# EAGLE design Utility Module (EAGLE 7.7.0)
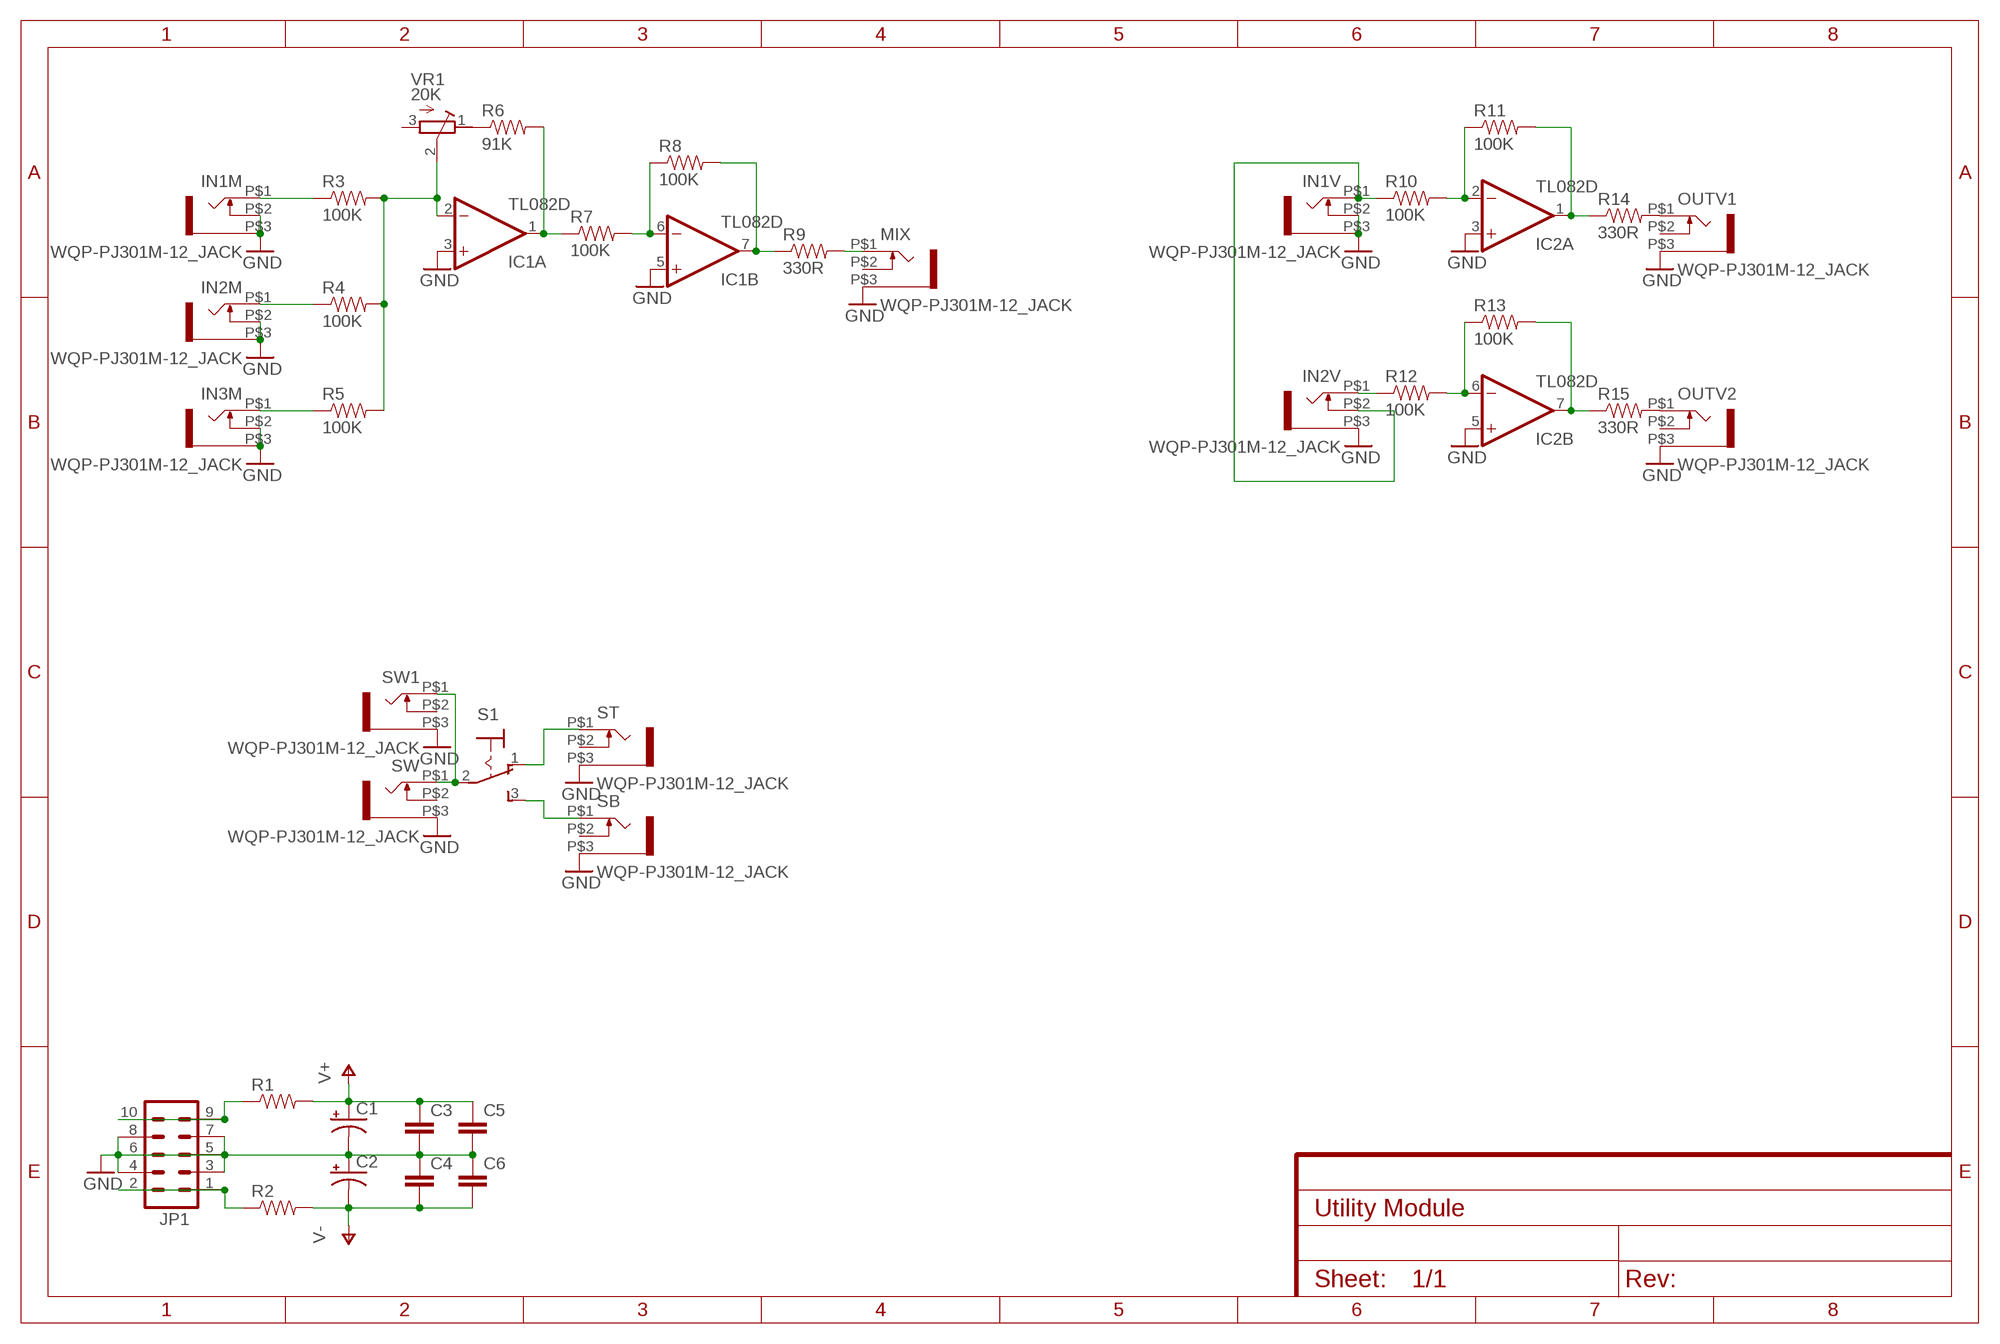
[diagram p0: schematic, sheet 1]

## Parts
C1  CAP_POLC  [PANASONIC_C]
C2  CAP_POLC  [PANASONIC_C]
C3  CAP0805  [0805]
C4  CAP0805  [0805]
C5  CAP0805  [0805]
C6  CAP0805  [0805]
IC1  TL082D  [SO08]
IC2  TL082D  [SO08]
IN1M  WQP-PJ301M-12_JACK  [WQP-PJ301M-12_JACK]
IN1V  WQP-PJ301M-12_JACK  [WQP-PJ301M-12_JACK]
IN2M  WQP-PJ301M-12_JACK  [WQP-PJ301M-12_JACK]
IN2V  WQP-PJ301M-12_JACK  [WQP-PJ301M-12_JACK]
IN3M  WQP-PJ301M-12_JACK  [WQP-PJ301M-12_JACK]
JP1  M05X2PTH  [AVR_ICSP]
MIX  WQP-PJ301M-12_JACK  [WQP-PJ301M-12_JACK]
OUTV1  WQP-PJ301M-12_JACK  [WQP-PJ301M-12_JACK]
OUTV2  WQP-PJ301M-12_JACK  [WQP-PJ301M-12_JACK]
R1  RESISTOR0805-RES  [0805]
R2  RESISTOR0805-RES  [0805]
R3  100K  RESISTOR0805-RES  [0805]
R4  100K  RESISTOR0805-RES  [0805]
R5  100K  RESISTOR0805-RES  [0805]
R6  91K  RESISTOR0805-RES  [0805]
R7  100K  RESISTOR0805-RES  [0805]
R8  100K  RESISTOR0805-RES  [0805]
R9  330R  RESISTOR0805-RES  [0805]
R10  100K  RESISTOR0805-RES  [0805]
R11  100K  RESISTOR0805-RES  [0805]
R12  100K  RESISTOR0805-RES  [0805]
R13  100K  RESISTOR0805-RES  [0805]
R14  330R  RESISTOR0805-RES  [0805]
R15  330R  RESISTOR0805-RES  [0805]
S1  M9040P  [M9040P]
SB  WQP-PJ301M-12_JACK  [WQP-PJ301M-12_JACK]
ST  WQP-PJ301M-12_JACK  [WQP-PJ301M-12_JACK]
SW  WQP-PJ301M-12_JACK  [WQP-PJ301M-12_JACK]
SW1  WQP-PJ301M-12_JACK  [WQP-PJ301M-12_JACK]
VR1  20K  R-TRIMM3314G  [RTRIM3314G]

## Nets
GND: C1.- C2.+ C3.2 C4.1 C5.2 C6.1 IC1.3(A:+IN) IC1.5(B:+IN) IC2.3(A:+IN) IC2.5(B:+IN) IN1M.P$2 IN1M.P$3 IN1V.P$2 IN1V.P$3 IN2M.P$2 IN2M.P$3 IN2V.P$3 IN3M.P$2 IN3M.P$3 JP1.3 JP1.4 JP1.5 JP1.6 JP1.7 JP1.8 MIX.P$3 OUTV1.P$3 OUTV2.P$3 SB.P$3 ST.P$3 SW1.P$3 SW.P$3
N$1: R6.1 VR1.1(E)
N$2: IN1M.P$1 R3.1
N$3: JP1.9 JP1.10 R1.1
N$4: JP1.1 JP1.2 R2.1
N$5: IN2M.P$1 R4.1
N$6: IN3M.P$1 R5.1
N$7: IC1.2(A:-IN) R3.2 R4.2 R5.2 VR1.2(S)
N$8: MIX.P$1 R9.2
N$9: IC1.1(A:OUT) R6.2 R7.1
N$10: IC1.6(B:-IN) R7.2 R8.1
N$11: IC1.7(B:OUT) R8.2 R9.1
N$12: IN1V.P$1 IN2V.P$2 R10.1
N$13: S1.2(P) SW1.P$1 SW.P$1
N$14: IN2V.P$1 R12.1
N$15: IC2.6(B:-IN) R12.2 R13.1
N$16: IC2.2(A:-IN) R10.2 R11.1
N$17: IC2.1(A:OUT) R11.2 R14.1
N$18: IC2.7(B:OUT) R13.2 R15.1
N$19: OUTV1.P$1 R14.2
N$20: OUTV2.P$1 R15.2
N$21: S1.1(O) ST.P$1
N$22: S1.3(S) SB.P$1
V+: C1.+ C3.1 C5.1 R1.2
V-: C2.- C4.2 C6.2 R2.2
Unconnected: MIX.P$2 OUTV1.P$2 OUTV2.P$2 SB.P$2 ST.P$2 SW1.P$2 SW.P$2 VR1.3(A)

## Power pins joined to a net without a drawn wire
V+: IC1.8(P:V+) IC2.8(P:V+)
V-: IC1.4(P:V-) IC2.4(P:V-)

## Library data of the parts
C1 C2 = SparkFun-Capacitors:CAP_POL: Capacitor Polarized These are standard SMD and PTH capacitors. Normally 10uF, 47uF, and 100uF in electrolytic and tantalum varieties. Always verify the external diameter of the through hole cap, it varies with capacity, voltage, and manufacturer. The EIA devices should be standard.
C3-C6 = SparkFun-Passives:CAP: Capacitor Standard 0603 ceramic capacitor, and 0.1" leaded capacitor.
IC1 IC2 = linear:TL082: OP AMP Data sheet <http://www.ti.com/lit/ds/symlink/tl084a . pdf>; DATA_SHEET: <a href="http://www.ti.com/lit/ds/symlink/tl084a.pdf"> Data sheet </a>
IN1M IN1V IN2M IN2V IN3M MIX OUTV1 OUTV2 SB ST SW SW1 = thonkiconn:WQP-PJ301M-12_JACK
JP1 = SparkFun-Connectors:M05X2: Header 5x2 Standard 10-pin dual row 0.1" header. Commonly used with AVR-ISP. Use with Spark Fun Electronics SKU: PRT-00778
R1-R15 = SparkFun-Resistors:RESISTOR: Resistor Basic schematic elements and footprints for 0603, 1206, and PTH resistors.
S1 = switch:M9040P: TOGGLE SWITCH Marquardt
VR1 = rcl:R-TRIMM: Trimm resistor

## Board
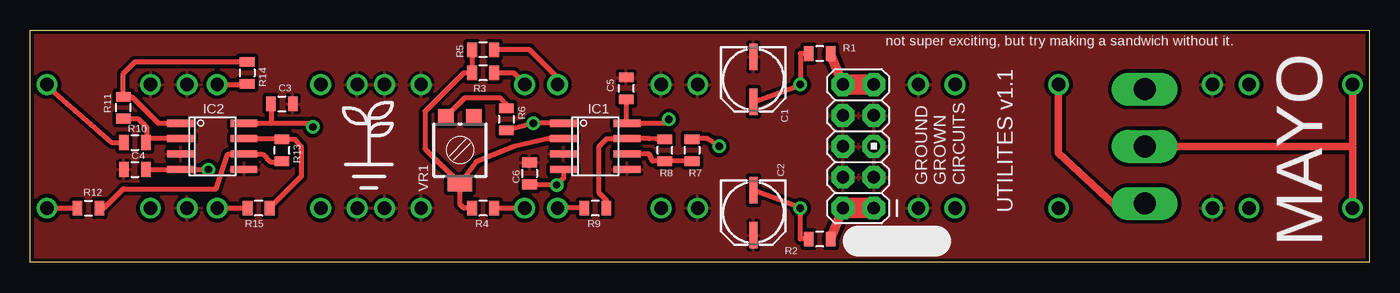
[diagram p1: board, top side]
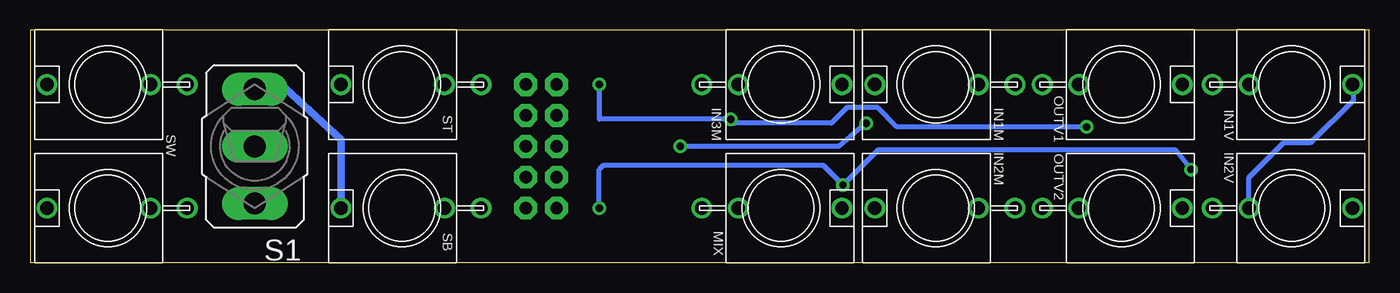
[diagram p2: board, bottom side, seen from below]

Size 109.86 x 19.05 mm. Coordinates in mm from the lower left corner, seen from the top.
Outline: 0,0 0,19.05 109.86,19.05 109.86,0 0,0
Copper layers (1*16): Top 0.035mm / dielectric 1.5mm / Bottom 0.035mm
Design rules "SparkFun": minimum track width 8mil, minimum drill 20mil, track to track 8mil, track to pad 8mil, pad to pad 8mil, via to via 8mil, smd to smd 8mil, copper to edge 8mil, drill to drill 8mil, minimum pad ring 12mil, minimum via ring 10mil, stop-mask expansion 4mil, vias tented up to drill 20mil, thermal gap 10mil

### Footprints (pad centres in the part's own frame; a part is rotated, then mirrored left to right if it is on the bottom)
PANASONIC_C = smd 2.2 x 0.65: + 1.9,-0.2; - -1.8,-0.2
0805 = smd 0.8 x 1.2: 1 -0.9,0; 2 0.9,0
SO08 = smd 0.6 x 2.2: 1 -1.905,-2.6; 2 -0.635,-2.6; 3 0.635,-2.6; 4 1.905,-2.6; 5 1.905,2.6; 6 0.635,2.6; 7 -0.635,2.6; 8 -1.905,2.6
WQP-PJ301M-12_JACK = drill 1.1: P$1 0,5; P$2 0,-3.5; P$3 0,-6.5
AVR_ICSP = drill 1.016 pad 1.88 octagon: 1 -1.27,5.08; 2 1.27,5.08; 3 -1.27,2.54; 4 1.27,2.54; 5 -1.27,0; 6 1.27,0; 7 -1.27,-2.54; 8 1.27,-2.54; 9 -1.27,-5.08; 10 1.27,-5.08
M9040P = drill 1.803 long: 1 0,4.699; 2 0,0; 3 0,-4.699
RTRIM3314G = smd 1.3 x 1.3: 1 1.15,-2.75; 3 -1.15,-2.75 | smd 2 x 1.3: 2 0,2.75

### Placement (x,y rotation side)
C1  59.53,15.08 270 top
C2  59.53,4.13 270 top
C3  20.64,13.02 0 top
C4  8.57,7.62 0 top
C5  48.9,14.29 90 top
C6  40.96,7.3 270 top
IC1  46.35,9.53 270 top
IC2  14.92,9.53 270 top
IN1M  35.56,14.61 90 bottom
IN1V  6.35,14.61 270 bottom
IN2M  35.56,4.45 90 bottom
IN2V  6.35,4.45 270 bottom
IN3M  48.26,14.61 270 bottom
JP1  67.94,9.53 180 top
MIX  48.26,4.45 270 bottom
OUTV1  20.32,14.61 270 bottom
OUTV2  20.32,4.45 270 bottom
R1  64.77,17.14 180 top
R2  64.77,1.91 180 top
R3  37.15,15.56 180 top
R4  37.15,4.45 180 top
R5  37.15,17.46 180 top
R6  39.05,11.75 270 top
R7  54.29,9.21 270 top
R8  52.07,9.21 90 top
R9  46.35,4.45 180 top
R10  8.57,9.84 0 top
R11  7.62,12.7 90 top
R12  4.76,4.45 0 top
R13  20.64,9.21 90 top
R14  17.78,15.56 270 top
R15  18.73,4.45 180 top
S1  91.44,9.53 180 bottom
SB  79.38,4.45 90 bottom
ST  79.38,14.61 90 bottom
SW  103.5,14.61 90 bottom
SW1  103.5,4.45 90 bottom
U$1  [LOGO_SMALL]  27.78,8.1 0 top
VR1  35.24,9.21 180 top

### Tracks (layer width: path | path; a pad name or v marks a point on that pad's centre or on a via)
GND
  pour Top (isolate 0.305): 0,0 0,19.05 109.86,19.05 109.86,0
N$1
  Top 0.406: R6.1 39.05,13.02 38.58,13.49 35.63,13.49 VR1.1
N$2
  Top 0.406: IN1M.P$1 40.56,14.69 39.69,15.56 R3.1
N$3
  Top 0.813: JP1.10 R1.1
  Top 1.676: JP1.10 JP1.9
N$4
  Top 0.813: JP1.2 R2.1
  Top 1.676: JP1.2 JP1.1
N$5
  Top 0.406: R4.1 IN2M.P$1
N$6
  Top 0.406: IN3M.P$1 43.26,15.16 40.96,17.46 R5.1
N$7
  Top 0.406: R5.2 R3.2 35.56,15.56 32.38,12.38 32.38,9.31 VR1.2 | R4.2 35.56,4.45 35.24,4.76 VR1.2 | IC1.2 42.55,10.16 39.69,9.53 36.56,8.26 VR1.2 | 35.45,6.67 VR1.2
N$8
  Top 0.406: R9.2 MIX.P$1
N$9  (via drill 0.6)
  Top 0.406: IC1.1 v41.27,11.43 41.06,11.38 R6.2 | v56.52,9.53 55.56,10.16 54.34,10.16 R7.1
  Bottom 0.406: v41.27,11.43 43.5,9.53 v56.52,9.53
N$10
  Top 0.406: R7.2 R8.1 51.06,8.31 50.8,8.89 IC1.6
N$11
  Top 0.406: R8.2 51.38,10.11 50.8,10.16 IC1.7 47.31,10.16 46.67,9.53 46.67,5.71 47.26,5.13 R9.1
N$12
  Top 0.406: IN1V.P$1 1.35,14.53 6.67,9.84 R10.1
  Bottom 0.406: IN2V.P$2 9.85,6.98 6.99,9.84 4.76,9.84 1.27,13.34 1.27,14.53 IN1V.P$1
N$13
  Top 0.406: 108.5,9.45 108.5,9.61 108.43,9.53
  Top 0.61: S1.2 108.43,9.53 108.5,9.76 SW.P$1 | SW1.P$1 108.5,9.45
N$14
  Top 0.406: IN2V.P$1 R12.1
N$15
  Top 0.406: R13.1 20.59,8.26 19.68,8.26 19.05,8.89 IC2.6 16.19,8.89 15.24,6.03 7.62,6.03 6.03,4.45 R12.2
N$16
  Top 0.406: R11.1 8.84,11.8 9.53,11.11 9.53,9.89 R10.2 9.79,10.16 IC2.2
N$17
  Top 0.406: IC2.1 10.48,11.43 8.31,13.6 R11.2 7.62,15.51 8.57,16.46 R14.1
N$18
  Top 0.406: IC2.7 20.59,10.16 R13.2 21.64,10.11 22.23,9.53 22.23,7.04 R15.1
N$19
  Top 0.406: OUTV1.P$1 17.73,14.61 R14.2
N$20
  Top 0.406: OUTV2.P$1 R15.2
N$21
  Top 0.61: ST.P$1 84.38,8.97 88.9,4.76 91.69,4.76 S1.1
N$22
  Bottom 0.61: SB.P$1 84.38,10.08 88.9,14.29 91.69,14.29 S1.3
V+  (via drill 0.6)
  Top 0.406: C1.+ 63.18,14.56 v63.18,14.61 63.18,17.14 R1.2 | v52.39,11.75 52.07,11.43 IC1.8 48.9,11.49 C5.1 | IC2.8 19.68,11.43 | 19.68,11.43 22.86,11.43 v23.18,11.11 | C3.1 19.74,11.48 19.68,11.43
  Bottom 0.406: v63.18,14.61 63.18,11.75 v52.39,11.75 52.07,11.43 44.13,11.43 42.86,12.7 40.32,12.7 38.73,11.11 v23.18,11.11
V-  (via drill 0.6)
  Top 0.406: R2.2 63.18,1.91 v63.18,4.45 63.18,4.49 C2.- | C6.2 43.13,6.4 v43.18,6.35 43.76,6.92 IC1.4 | C4.2 IC2.4 v14.61,7.62
  Bottom 0.406: v63.18,4.45 63.18,7.62 62.87,7.94 44.77,7.94 v43.18,6.35 40.32,9.21 15.88,9.21 v14.61,7.62

### Text on the board
tPlace: not super exciting, but try making a sandwich without it. | MAYO | UTILITES v1.1 | GROUND / GROWN / CIRCUITS